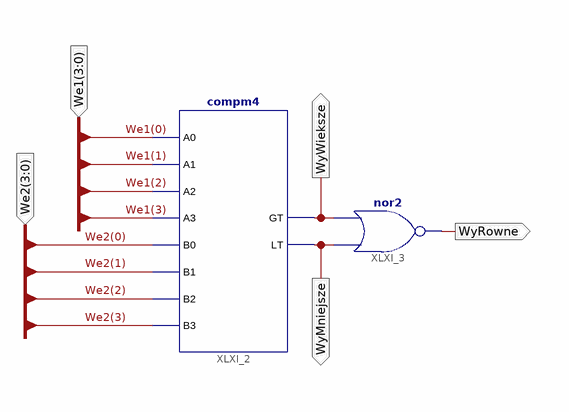
[diagram p0: schematic sheet 1]
// Xilinx ISE schematic schemat.sch (xc9500xl) as structural Verilog: 2 symbols, 5 ports
module schemat (
  input  [3:0] We1,
  input  [3:0] We2,
  output WyWieksze,
  output WyMniejsze,
  output WyRowne
);

  compm4 XLXI_2 (
    .A0(We1[0]), .A1(We1[1]), .A2(We1[2]), .A3(We1[3]), .B0(We2[0]), .B1(We2[1]), .B2(We2[2]), .B3(We2[3]),
    .GT(WyWieksze), .LT(WyMniejsze));
  nor XLXI_3 (WyRowne, WyMniejsze, WyWieksze);
endmodule
